# Altium schematic sheet SS34.schdoc
size 127 x 101 mm
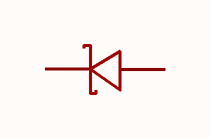
[diagram p0: SS34.schdoc]

## Parts
D?  SS34  [SMC_L6.9-W5.9-LS7.9-RD]  (value not drawn)

## Nets

Not connected (* = marked no-connect by the designer): D? 1(C) 2(A)

## Library data of the parts
D? = SS34_C154551: Manufacturer: onsemi(安森美); Add into BOM: yes; Forward Voltage (Vf@If): 500mV@3A; Reverse Voltage (Vr): 40V; Rectified Current: 3A; Reverse Leakage Current (Ir): 500uA@40V; Symbol: SS34_C154551; Device: SS34_C154551; LCSC Part Name: 电压:40V 电流:3A; Supplier Part: C154551; Manufacturer Part: SS34; Supplier Footprint: SMC(DO-214AB); JLCPCB Part Class: Extended Part; Datasheet: https://atta.szlcsc.com/upload/public/pdf/source/20230523/C977B907190B075B30FD168351032A84.pdf; Supplier: LCSC; Convert to PCB: yes